# EAGLE design diskohedron4w_pinheaders (EAGLE 6.5.0)
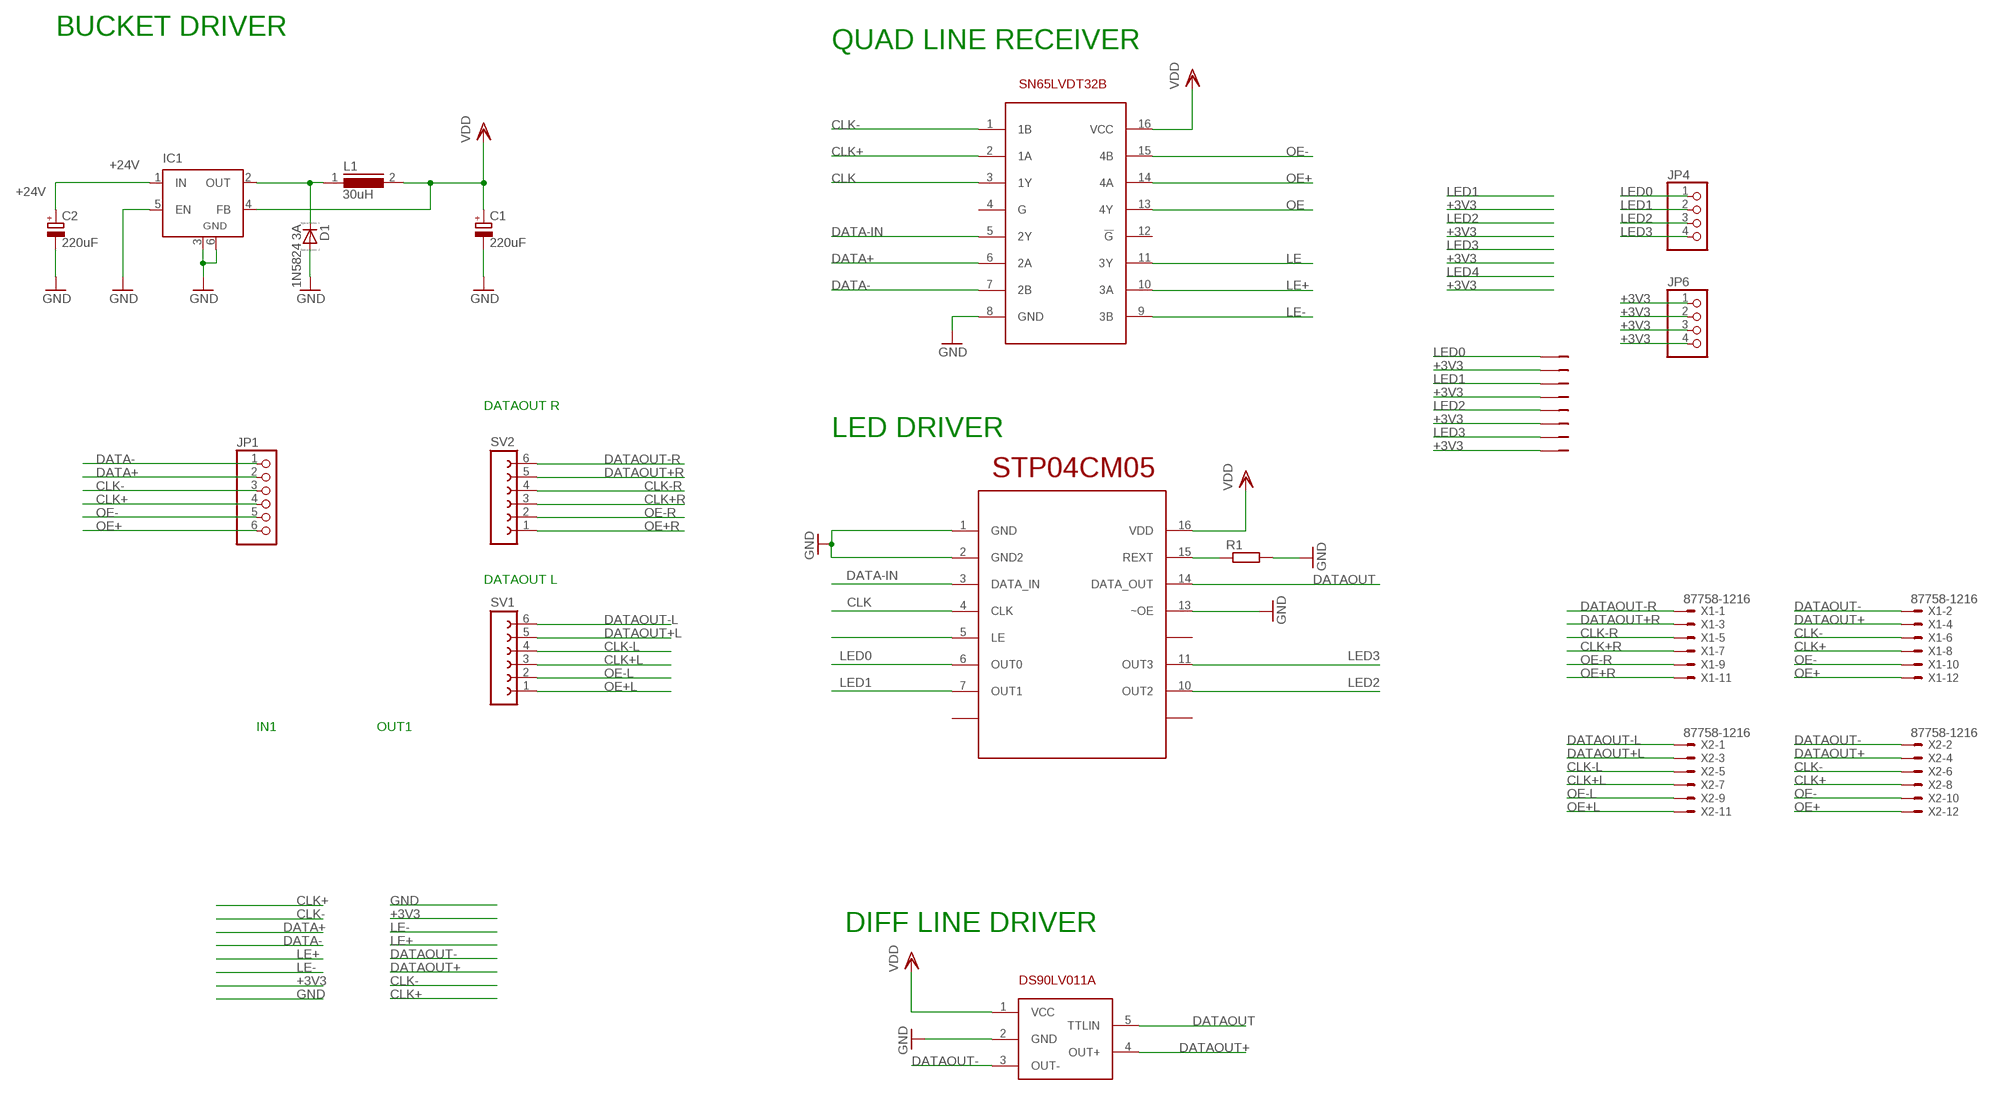
[diagram p0: schematic, sheet 1]

## Parts
C1  220uF  CPOL-EU153CLV-1010  [153CLV-1010]
C2  220uF  CPOL-EU153CLV-1010  [153CLV-1010]
D1  1N5824 3A  DIODE_E-SMC  [DIODE_SMC]
IC1  LM2596S  [TO263-5]
JP1  PINHD-1X06_2.54-90°  [1X06/90]
JP4  PINHD-1X4  [1X04]
JP6  PINHD-1X4  [1X04]
L1  30uH  DR127  [DR127]
R1  R-EU_M0805  [M0805]
SV1  FE06W  [FE06W]
SV2  FE06W  [FE06W]
U$1  STP04CM05  [TSSOP16]
U$2  SN65LVDST32  [SOIC16]
U$3  DS90LV011A  [SOT23-5]
U$4  8PIN-ZH  [B8B-ZH]
X1  87758-1216  [87758-1216]
X2  87758-1216  [87758-1216]

## Nets
+3V3: C1.+ IC1.4(FB) JP6.1 JP6.2 JP6.3 JP6.4 L1.2 U$1.16(VDD) U$2.16(VCC) U$3.1(VCC) U$4.2 U$4.4 U$4.6 U$4.8 ; supply symbol labelled VDD
+24V: C2.+ IC1.1(IN)
CLK: U$1.4(CLK) U$2.3(1Y)
CLK+: JP1.4 U$2.2(1A) X1.8 X2.8
CLK+L: SV1.3 X2.7
CLK+R: SV2.3 X1.7
CLK-: JP1.3 U$2.1(1B) X1.6 X2.6
CLK-L: SV1.4 X2.5
CLK-R: SV2.4 X1.5
DATA+: JP1.2 U$2.6(2A)
DATA-: JP1.1 U$2.7(2B)
DATA-IN: U$1.3(DATA_IN) U$2.5(2Y)
DATAOUT: U$1.14(DATA_OUT) U$3.5(TTLIN)
DATAOUT+: U$3.4(OUT+) X1.4 X2.4
DATAOUT+L: SV1.5 X2.3
DATAOUT+R: SV2.5 X1.3
DATAOUT-: U$3.3(OUT-) X1.2 X2.2
DATAOUT-L: SV1.6 X2.1
DATAOUT-R: SV2.6 X1.1
GND: C1.- C2.- D1.A(C) IC1.3(GND) IC1.5(EN) IC1.6(GND) R1.2 U$1.1(GND) U$1.2(GND2) U$1.13(~OE) U$2.8(GND) U$3.2(GND)
LE: U$1.5(LE) U$2.11(3Y)
LE+: U$2.10(3A)
LE-: U$2.9(3B)
LED0: JP4.1 U$1.6(OUT0) U$4.1
LED1: JP4.2 U$1.7(OUT1) U$4.3
LED2: JP4.3 U$1.10(OUT2) U$4.5
LED3: JP4.4 U$1.11(OUT3) U$4.7
N$1: R1.1 U$1.15(REXT)
N$2: D1.C(A) IC1.2(OUT) L1.1
OE: U$2.13(4Y)
OE+: JP1.6 U$2.14(4A) X1.12 X2.12
OE+L: SV1.1 X2.11
OE+R: SV2.1 X1.11
OE-: JP1.5 U$2.15(4B) X1.10 X2.10
OE-L: SV1.2 X2.9
OE-R: SV2.2 X1.9
Unconnected: U$1.8(N.C1) U$1.9(NC) U$1.12(NC3) U$2.4(G) U$2.12(!G)

## Notes on the sheet
- BUCKET DRIVER
- QUAD LINE RECEIVER
- DATAOUT R
- LED DRIVER
- DATAOUT L
- IN1 | OUT1
- DIFF LINE DRIVER

## Library data of the parts
C1 C2 = rcl:CPOL-EU: POLARIZED CAPACITOR, European symbol
D1 = eagle-ltspice:DIODE_E-: Schottky Diode; SPICEMODEL: diode; SPICEPREFIX: D
IC1 = linear:LM2596S: STEP-DOWN VOLTAGE REGULATOR
JP1 = pinhead-2:PINHD-1X06: PIN HEADER
JP4 JP6 = pinhead:PINHD-1X4: PIN HEADER
L1 = inductors:DR127: High Power Density, High Efficiency, Shielded Inductors Source: coiltronics_dr_series.pdf
R1 = resistor:R-EU_: RESISTOR, European symbol
SV1 SV2 = con-lsta:FE06W: FEMALE HEADER; OC_FARNELL: unknown; OC_NEWARK: unknown
U$1 = stp04:STP04CM05
U$2 = diskohedron:SN65LVDST32
U$3 = diskohedron:DS90LV011A: 3V LVDS Single High Speed Differential Driver
U$4 = diskohedron:8PIN-ZH
X1 X2 = con-molex:87758-1216: 12 Pin - 2mm Dual Row Single Wafer, Vertical T/H HDR Source: http://www.molex.com/pdm_docs/sd/877580616_sd.pdf; MPN: 87758-1216; OC_FARNELL: unknown; OC_NEWARK: 25M5671

## Board
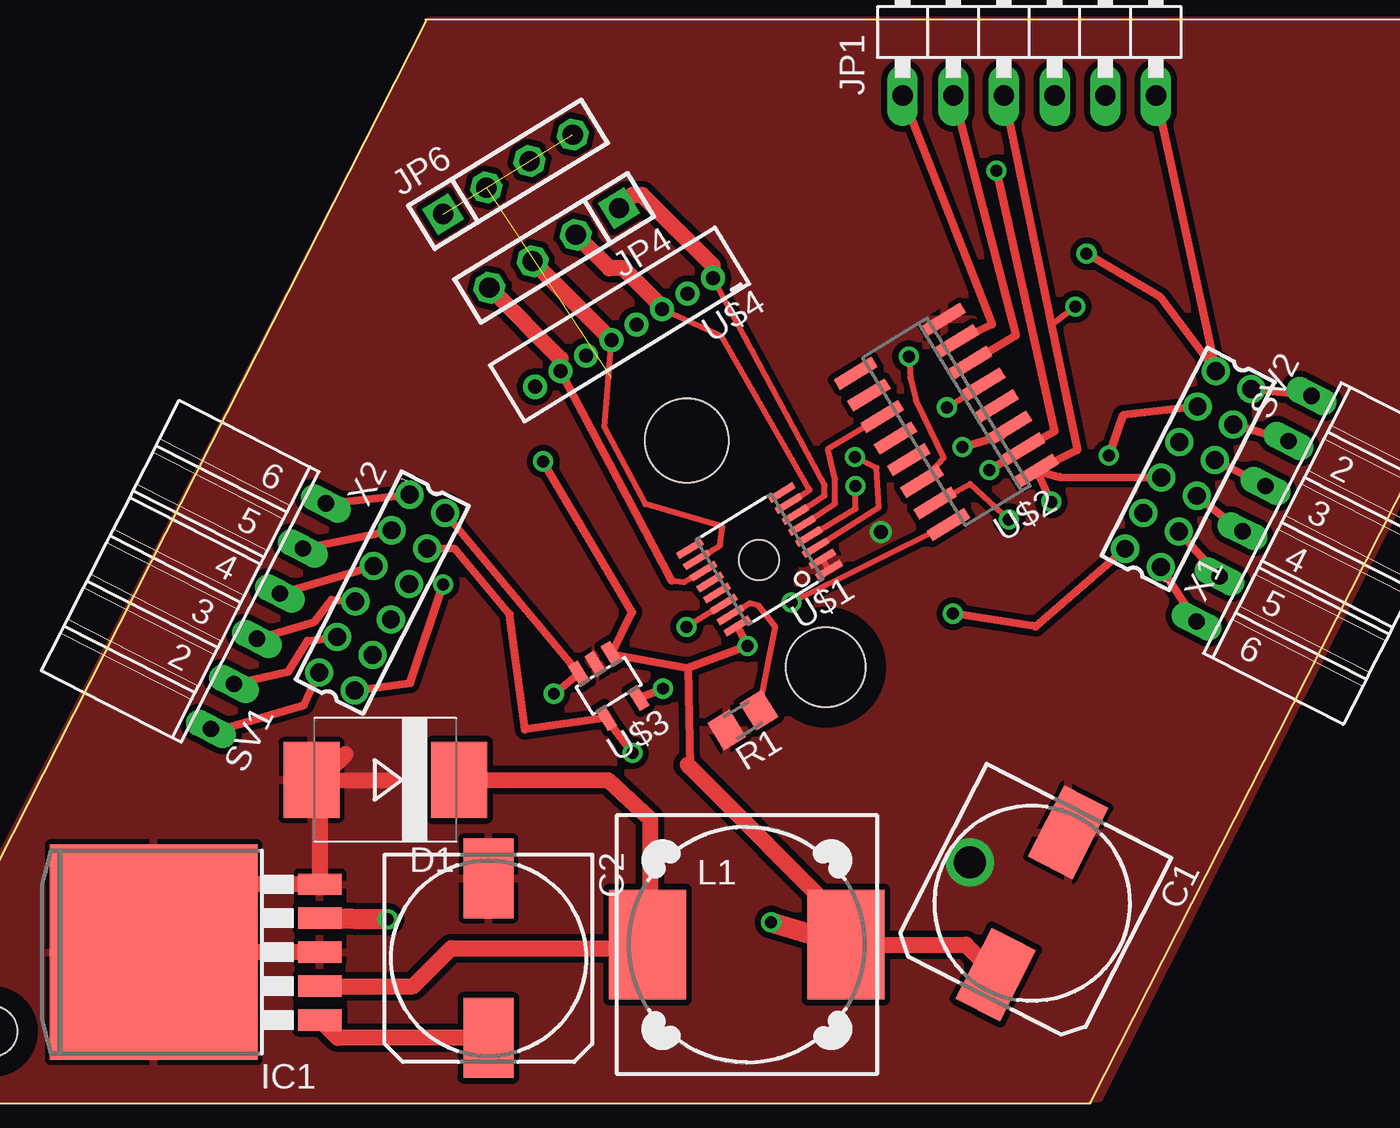
[diagram p1: board, top side]
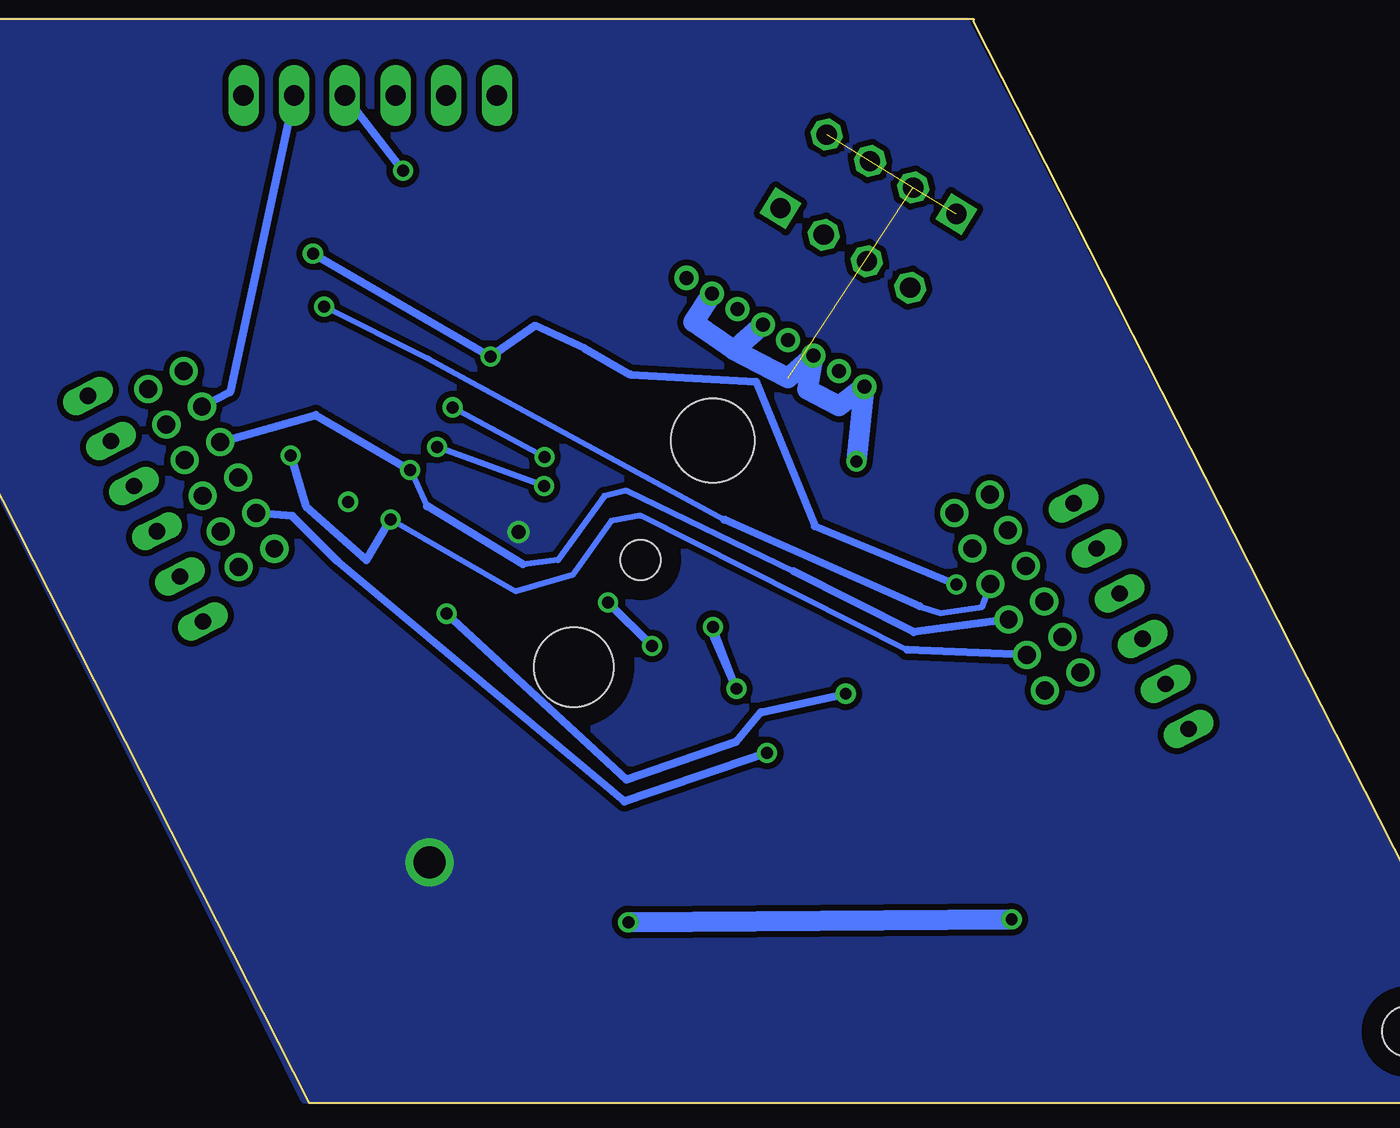
[diagram p2: board, bottom side, seen from below]

No outline drawn. Coordinates in mm, seen from the top.
Copper layers (1*16): Top 0.035mm / dielectric 1.5mm / Bottom 0.035mm
Design rules "default *": minimum track width 10mil, minimum drill 24mil, track to track 12mil, track to pad 12mil, pad to pad 12mil, via to via 8mil, smd to smd 8mil, copper to edge 40mil, drill to drill 8mil, minimum pad ring 10mil, minimum via ring 8mil, stop-mask expansion 4mil, vias tented up to drill 0mil, thermal gap 10mil
Holes 4.2 mm at 40.71,33.22
Holes 4 mm at 47.68,21.85
Holes 2 mm at 44.33,27.23
Holes 2.5 mm at 5.9,3.59 82.69,50.84
Milling: 4 lines

### Footprints (pad centres in the part's own frame; a part is rotated, then mirrored left to right if it is on the bottom)
153CLV-1010 = smd 4 x 2.5: + 4,0; - -4,0
DIODE_SMC = smd 2.8 x 3.8: A 3.7,0; C -3.7,0
TO263-5 = smd 1.067 x 2.159: 1 -3.404,-5.791; 2 -1.702,-5.791; 3 0,-5.791; 4 1.702,-5.791; 5 3.404,-5.791 | smd 10.8 x 10.41: 6 0,2.54
1X06/90 = drill 1.016 long: 1 -6.35,-3.81; 2 -3.81,-3.81; 3 -1.27,-3.81; 4 1.27,-3.81; 5 3.81,-3.81; 6 6.35,-3.81
1X04 = drill 1.016 square: 1 -3.81,0 | drill 1.016 octagon: 2 -1.27,0; 3 1.27,0; 4 3.81,0
DR127 = smd 3.85 x 5.5: 1 -4.975,0; 2 4.975,0
M0805 = smd 1.3 x 1.6: 1 -0.95,0; 2 0.95,0
FE06W = drill 0.813 long: 1 -6.35,0; 2 -3.81,0; 3 -1.27,0; 4 1.27,0; 5 3.81,0; 6 6.35,0
TSSOP16 = smd 0.35 x 1.43: 1 -2.275,-2.7; 2 -1.625,-2.7; 3 -0.975,-2.7; 4 -0.325,-2.7; 5 0.325,-2.7; 6 0.975,-2.7; 7 1.625,-2.7; 8 2.275,-2.7; 9 2.275,2.7; 10 1.625,2.7; 11 0.975,2.7; 12 0.325,2.7; 13 -0.325,2.7; 14 -0.975,2.7; 15 -1.625,2.7; 16 -2.275,2.7
SOIC16 = smd 0.6 x 2.2: 1 -4.445,-2.6; 2 -3.175,-2.6; 3 -1.905,-2.6; 4 -0.635,-2.6; 5 0.635,-2.6; 6 1.905,-2.6; 7 3.175,-2.6; 8 4.445,-2.6; 9 4.445,2.6; 10 3.175,2.6; 11 1.905,2.6; 12 0.635,2.6; 13 -0.635,2.6; 14 -1.905,2.6; 15 -3.175,2.6; 16 -4.445,2.6
SOT23-5 = smd 0.55 x 1.2: 1 -0.95,-1.3; 2 0,-1.3; 3 0.95,-1.3; 4 0.95,1.3; 5 -0.95,1.3
B8B-ZH = drill 0.7 pad 1.1: 1 -2.25,0; 2 -0.75,0; 3 0.75,0; 4 2.25,0; 5 3.7,0; 6 5.2,0; 7 6.7,0; 8 8.2,0
87758-1216 = drill 0.9 pad 1.27: 1 -5,-1; 2 -5,1; 3 -3,-1; 4 -3,1; 5 -1,-1; 6 -1,1; 7 1,-1; 8 1,1; 9 3,-1; 10 3,1; 11 5,-1; 12 5,1

### Placement (x,y rotation side)
C1  58.03,10.01 243 top
C2  30.77,7.27 270 top
D1  25.6,16.2 180 top
IC1  16.53,7.56 90 top
JP1  57.89,54.33 0 top
JP4  34.07,42.87 211.5 top
JP6  31.75,46.56 31.5 top
L1  43.73,7.94 0 top
R1  43.53,19.21 211.5 top
SV1  19.74,24.41 63 top
SV2  69.16,29.8 243 top
U$1  44.36,27.26 121.5 top
U$2  53.73,34.15 121.5 top
U$3  36.81,20.92 211.5 top
U$4  40.11,40.2 211.5 top
X1  65.86,31.79 63 top
X2  25.45,25.59 243 top

### Tracks (layer width: path | path; a pad name or v marks a point on that pad's centre or on a via)
+3V3  (via drill 0.6)  (4 unrouted)
  Top 0.305: U$2.16 v45.96,25.1
  Top 0.406: U$1.16 v43.76,22.92 40.78,21.81 | 40.78,21.81 U$3.1 37.98,24.61 v33.52,32.17 | 40.78,21.81 40.87,16.85
  Top 0.813: C1.+ 54.72,7.94 L1.2 48.7,9.02 40.87,16.85 40.76,16.96
  Top 1.016: IC1.4 v25.73,9.21 | v44.95,9.07 L1.2
  Bottom 0.406: v45.96,25.1 v43.76,22.92
  Bottom 1.016: v33.52,32.17 U$4.8 34.4,34.95 35.97,35.77 U$4.6 36.94,36.35 38.34,37.08 39.66,37.75 | 39.66,37.75 U$4.4 | U$4.2 41.68,39.16 39.66,37.75 | v25.73,9.21 v44.95,9.07
+24V
  Top 0.813: C2.+ 23.22,3.27 IC1.1
CLK  (via drill 0.6)
  Top 0.305: U$1.4 49.17,29.81 v49.18,30.93
  Top 0.406: v54.53,32.89 56.56,33.49 U$2.3
  Bottom 0.305: v49.18,30.93 v54.53,32.89
CLK+  (via drill 0.6)
  Top 0.406: v56.25,46.74 59.15,33.67 U$2.2 v55.89,31.74
  Bottom 0.305: 36.66,26.66 45.04,30.7 46.15,30.45 48.47,27.22 50.23,27.01 | 55.05,29.93 55.9,31.81
  Bottom 0.406: JP1.4 v56.25,46.74 | X1.8 60.62,34.49 v55.89,31.74 55.9,31.81 | X2.8 30.64,23.61 36.66,26.66 | 50.23,27.01 55.05,29.93
CLK+L
  Top 0.406: SV1.3 22.05,24.12 22.91,25.24 X2.7
CLK+R
  Top 0.406: SV2.3 X1.7
CLK-  (via drill 0.6)
  Top 0.305: v60.2,39.93 59,39.01
  Top 0.406: U$2.1 59.4,31.4 X1.6 | JP1.3 59,39.01 60.3,32.74 U$2.1 | v59,30.14 U$2.1
  Bottom 0.305: 40.14,29.24 55.01,37.33 v60.2,39.93 | 30.34,24.9 29.3,24.56 27.2,24.87 X2.6
  Bottom 0.406: 30.34,24.9 40.09,29.24 40.14,29.24
CLK-L
  Top 0.406: SV1.4 X2.5
CLK-R
  Top 0.406: SV2.4 X1.5
DATA+
  Top 0.406: JP1.2 57.22,38.47 U$2.6
DATA-
  Top 0.406: JP1.1 56.04,39.04 U$2.7
DATA-IN  (via drill 0.6)
  Top 0.305: v49.15,32.4 50.24,31.84 50.34,29.87 U$1.3 | v53.77,34.88 U$2.5
  Bottom 0.305: v49.15,32.4 v53.77,34.88
DATAOUT  (via drill 0.6)
  Top 0.305: U$1.14 v40.71,23.88
  Top 0.406: U$3.5 v39.53,20.77
  Bottom 0.305: v40.71,23.88 v39.53,20.77
  Bottom 0.406: v39.53,20.77 40.82,23.75
DATAOUT+  (via drill 0.6)
  Top 0.406: v37.99,17.55 U$3.4 32.61,18.73 31.84,24.5 29.11,27.77 X2.4
  Bottom 0.406: v37.99,17.55 45.15,15.11 59.55,27.18 61.8,29.44 X1.4
DATAOUT+L
  Top 0.406: SV1.5 X2.3
DATAOUT+R
  Top 0.406: SV2.5 X1.3
DATAOUT-  (via drill 0.6)
  Top 0.406: X2.2 U$3.3 v34.05,20.52 | X1.2 58.22,23.89 v54.07,24.53
  Bottom 0.406: v54.07,24.53 45.04,16.23 39.53,18.12 38.31,19.59 v34.05,20.52
DATAOUT-L
  Top 0.406: SV1.6 X2.1
DATAOUT-R
  Top 0.406: SV2.6 X1.1
GND  (via drill 0.7, 1.6)
  Top 0.305: U$1.1 U$1.2
  Top 0.813: IC1.3 14.56,7.57 14.52,7.52 | 14.52,7.52 | 14.52,7.52 14.57,7.46 14.57,7.52 14.52,7.58 17.9,10.97 IC1.5 | IC1.5 | IC1.5 22.3,10.99 22.3,16.18 23.61,17.49 D1.A 25.87,16.16
  other vias: 54.92,12.06 50.45,28.63
  pour Bottom: 0.31,0.15 61.16,0.15 88.28,54.16 28.04,54.16
  pour Top (isolate 0.305): 0.08,0.25 61.41,0.25 88.52,54.26 27.81,54.26
  pour Bottom: 0.31,0.23 61.16,0.23 88.28,54.24 28.04,54.24
LE
  Top 0.305: U$2.11 47.8,32.8 48.16,31.29 48.16,30.07 U$1.5
LED0
  Top 0.305: U$1.6 47.62,30.47 47.62,30.98 U$4.1
  Top 0.813: U$4.1 42.03,41.99 38.48,45.53 37.99,45.53 JP4.1
LED1
  Top 0.305: U$1.7 46.87,30.73 42.46,38.44 U$4.3
  Top 0.813: U$4.3 39.47,39.91 37.52,41.85 36.83,41.85 JP4.2
LED2
  Top 0.305: U$4.5 36.59,33.9 38.64,30.03 42.5,28.9 42.39,27.96 U$1.10
  Top 0.813: U$4.5 36.93,38.26 JP4.3
LED3
  Top 0.305: 39.97,26.19 40.57,26.11 U$1.11
  Top 0.406: 39.97,26.19 U$4.7
  Top 0.813: U$4.7 34.4,37.31 JP4.4
N$1
  Top 0.305: R1.1 45.16,23.87 44.3,24.94 43.88,25.05 U$1.15
N$2
  Top 0.813: IC1.2 27.01,5.86 28.91,7.76 39.48,7.76 L1.1 38.86,8.05 38.86,14.24 36.76,16.19 D1.C
OE+  (via drill 0.6)
  Top 0.305: v51.85,37.43 51.92,36.35 52.2,35.24 53.6,32.34 U$2.14
  Top 0.406: JP1.6 X1.12 64.45,40.4 v60.76,42.59 | X2.12 26.85,21.06 v28.49,26.01
  Bottom 0.406: v60.76,42.59 v51.85,37.43 49.63,38.97 47.12,37.82 44.85,36.53 38.54,36.16 35.59,28.92 v28.49,26.01
OE+L
  Top 0.406: SV1.1 16.84,18.58 21.53,19.95 X2.11
OE+R
  Top 0.406: SV2.1 X1.11
OE-  (via drill 0.6)
  Top 0.305: v56.88,29.26 54.94,31.05 53.7,30.36
  Top 0.406: 53.7,30.36 U$2.15 | X1.10 62.59,34.49 v61.88,32.46
  Bottom 0.305: 30.98,22.73 44.35,29.45 45.8,29.19 47.73,26.48 50.59,25.66 v56.88,29.26
  Bottom 0.406: JP1.5 64.92,35.64 X1.10 | X2.10 30.98,22.73 | v61.88,32.46 61.12,29.94 58.08,27.22 v56.88,29.26
OE-L
  Top 0.406: SV1.2 20.76,21.63 21.7,23.18 X2.9
OE-R
  Top 0.406: SV2.2 X1.9